# Altium project mb1225.PrjPCB (part 1 of 2)
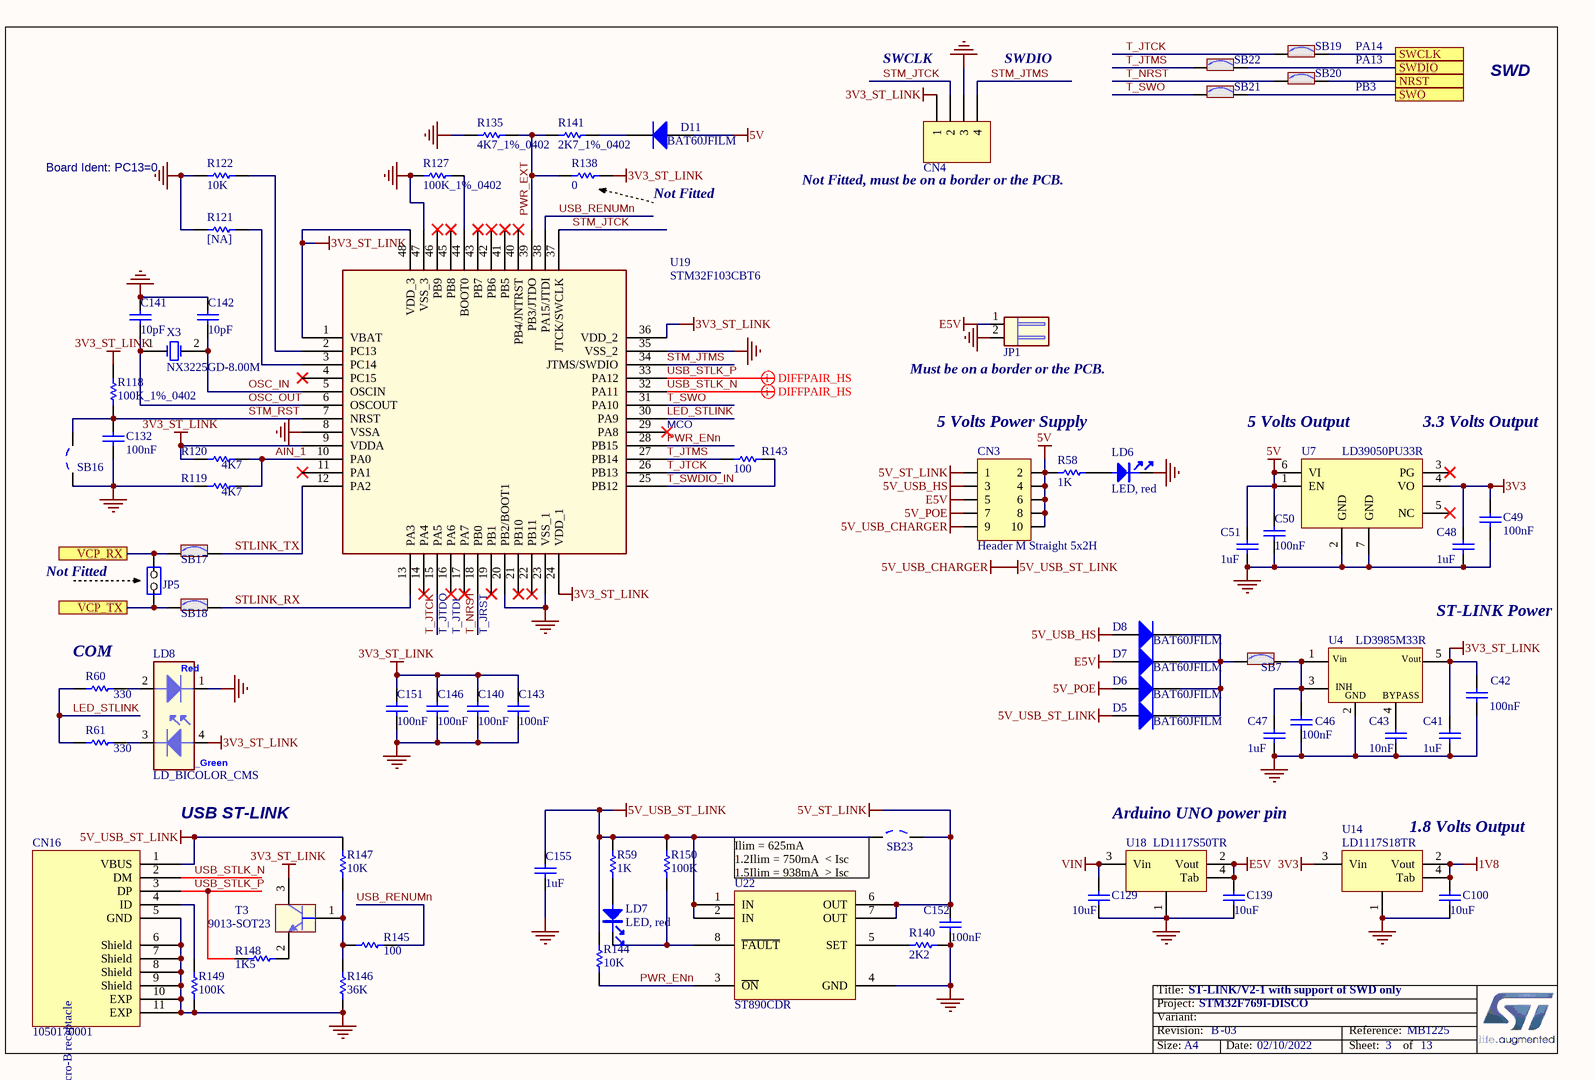
[diagram p0: ST_LINK_V2-1.SCHDOC]
Board_Reference: MB1225; Board_PCB_Revision: B; Board_Name: STM32F769I-DISCO; Board_document_Date: 02/10/2022; Board_Assembly_Revision: 03
8 sheets, 341 parts. Net scope: hierarchical (ports join the sheet entries above them; power ports are global).
Board file: MB1225.PcbDoc
Sheets:
  ST_LINK_V2-1.SCHDOC
  AUDIO.SchDoc
  SDRAM.SchDoc
  QSPI.SchDoc
  USB_OTG_HS.SchDoc
  Ethernet.SchDoc
    U_PoE = PoE.SchDoc
  Peripherals.SchDoc

## Sheet ST_LINK_V2-1.SCHDOC: ST-LINK/V2-1 with support of SWD only
size A4; Date: 29-OCT-2015; Author: A.B; CompanyName: STMicroelectronics; Organization: MCD/TOOLS/GNB; Address1: 12, Rue Jules HOROWITZ; Address2: 38019 Grenoble; Address3: FRANCE; DocumentNumber: MB1225; Revision: B-01; SheetNumber: 3; SheetTotal: 13; Project: STM32F769I-DISCO

### Parts
C41  1uF  [0603C]
C42  100nF  [0402C]
C43  10nF  [0603C]
C46  100nF  [0402C]
C47  1uF  [0603C]
C48  1uF  [0603C]
C49  100nF  [0402C]
C50  100nF  [0402C]
C51  1uF  [0603C]
C100  10uF  [0603C]
C129  10uF  [0805C]
C132  100nF  [0402C]
C139  10uF  [0805C]
C140  100nF  [0402C]
C141  10pF  [0402C]
C142  10pF  [0402C]
C143  100nF  [0402C]
C146  100nF  [0402C]
C151  100nF  [0402C]
C152  100nF  [0402C]
C155  1uF  [0603C]
CN3  Header M Straight 5x2H  [HDR_2X5_2R54]
CN4  Header 4  [HDR_1X4_2R54]  (value not drawn)
CN16  1050170001  [MICRO_USB_B_105017]
D5  BAT60JFILM  [SOD-323]
D6  BAT60JFILM  [SOD-323]
D7  BAT60JFILM  [SOD-323]
D8  BAT60JFILM  [SOD-323]
D11  BAT60JFILM  [SOD-323]
JP1  WF25402-06421  [HDR_1X2_2R54_RA_11R35]  (value not drawn)
JP5  JP2  [SIP2]  (value not drawn)
LD6  LED, red  [0603D]
LD7  LED, red  [0603D]
LD8  LD_BICOLOR_CMS  [LED2_3528]
R58  1K  [0402R]
R59  1K  [0402R]
R60  330  [0402R]
R61  330  [0402R]
R118  100K_1%_0402  [0402R]
R119  4K7  [0402R]
R120  4K7  [0402R]
R121  [NA]  [0402R]
R122  10K  [0402R]
R127  100K_1%_0402  [0402R]
R135  4K7_1%_0402  [0402R]
R138  0  [0402R]
R140  2K2  [0402R]
R141  2K7_1%_0402  [0402R]
R143  100  [0402R]
R144  10K  [0402R]
R145  100  [0402R]
R146  36K  [0402R]
R147  10K  [0402R]
R148  1K5  [0402R]
R149  100K  [0402R]
R150  100K  [0402R]
SB7  Solder Bridge ON  [JP2_SMD]  (value not drawn)
SB16  Solder Bridge OFF  [JP2_SMD]  (value not drawn)
SB17  Solder Bridge ON  [JP2_SMD]  (value not drawn)
SB18  Solder Bridge ON  [JP2_SMD]  (value not drawn)
SB19  Solder Bridge ON  [JP2_SMD]  (value not drawn)
SB20  Solder Bridge ON  [JP2_SMD]  (value not drawn)
SB21  Solder Bridge ON  [JP2_SMD]  (value not drawn)
SB22  Solder Bridge ON  [JP2_SMD]  (value not drawn)
SB23  Solder Bridge OFF  [JP2_SMD]  (value not drawn)
T3  9013-SOT23  [SOT-23]
U4  LD3985M33R  [SOT-23-5L]
U7  LD39050PU33R  [DFN6_0R95_3X3]
U14  LD1117S18TR  [SOT-223]
U18  LD1117S50TR  [SOT-223]
U19  STM32F103CBT6  [LQFP48_0R5_9X9]
U22  ST890CDR  [SOIC8_1R27_4R9X6]
X3  NX3225GD-8.00M  [XTAL_2SM_3R2X2R5_H1]

### Ports
NRST, SWCLK, SWDIO, SWO, VCP_RX, VCP_TX

### Nets
1V8: C100.2 U14.2(Vout) U14.4(Tab)
3V3: C48.2 C49.2 U7.4(VO) U14.3(Vin)
3V3_ST_LINK: C41.1 C42.2 C140.1 C143.2 C146.2 C151.2 CN4.1 LD8.4 R118.2 R120.1 R138.2 T3.3(C) U4.5(Vout) U19.1(VBAT) U19.9(VDDA) U19.24(VDD_1) U19.36(VDD_2) U19.48(VDD_3)
5V: C50.2 C51.2 CN3.2 CN3.4 CN3.6 CN3.8 CN3.10 D11.1(A) R58.1 U7.1(EN) U7.6(VI)
5V_POE: CN3.7 D6.1(A)
5V_ST_LINK: C152.2 CN3.1 SB23.2 U22.6(OUT) U22.7(OUT)
5V_USB_CHARGER: C155.2 CN3.9 CN16.1(VBUS) D5.1(A) R59.2 R144.2 R147.2 R150.2 SB23.1 U22.1(IN) U22.2(IN)  [also labelled 5V_USB_ST_LINK]
5V_USB_HS: CN3.3 D8.1(A)
E5V: C139.2 CN3.5 D7.1(A) JP1.1 U18.2(Vout) U18.4(Tab)
GND: C41.2 C42.1 C43.1 C46.1 C47.1 C48.1 C49.1 C50.1 C51.1 C100.1 C129.1 C132.1 C139.1 C140.2 C141.1 C142.1 C143.1 C146.1 C151.1 C152.1 C155.1 CN4.3 CN16.5(GND) CN16.6(Shield) CN16.7(Shield) CN16.8(Shield) CN16.9(Shield) CN16.10(EXP) CN16.11(EXP) JP1.2 LD6.2 LD8.1 R119.1 R121.1 R122.1 R127.1 R135.1 R140.2 R146.1 R149.1 SB16.1 U4.2(GND) U7.2(GND) U7.7(GND) U14.1 U18.1 U19.8(VSSA) U19.20(PB2/BOOT1) U19.23(VSS_1) U19.35(VSS_2) U19.47(VSS_3) U22.4(GND)  [project net POE7]
VIN: C129.2 U18.3(Vin)
AIN_1: R119.2 R120.2 U19.10(PA0)
LED_STLINK: R60.1 R61.1 U19.30(PA9)
NRST: SB20.2 ; port NRST
OSC_IN: C142.2 U19.5(OSCIN) X3.2(OSC2)
OSC_OUT: C141.2 U19.6(OSCOUT) X3.1(OSC1)
PWR_ENn: R144.1 U19.28(PB15) U22.3(~{ON})
PWR_EXT: R135.2 R138.1 R141.1 U19.39(PB3/JTDO)
STLINK_RX: SB18.2 U19.13(PA3)
STLINK_TX: SB17.2 U19.12(PA2)
STM_JTCK: CN4.2 U19.37(JTCK/SWCLK)
STM_JTMS: CN4.4 U19.34(JTMS/SWDIO)
STM_RST: C132.2 R118.1 SB16.2 U19.7(NRST)
SWCLK: SB19.2 ; port SWCLK
SWDIO: SB22.2 ; port SWDIO
SWO: SB21.2 ; port SWO
T_JTCK: SB19.1 U19.15(PA5) U19.26(PB13)
T_JTMS: R143.1 SB22.1 U19.27(PB14)
T_NRST: SB20.1 U19.18(PB0)
T_SWDIO_IN: R143.2 U19.25(PB12)
T_SWO: SB21.1 U19.31(PA10)
USB_RENUMn: R145.2 U19.38(PA15/JTDI)
USB_STLK_N: CN16.2(DM) U19.32(PA11)
USB_STLK_P: CN16.3(DP) R148.1 U19.33(PA12)
VCP_RX: JP5.2(NO) SB17.1 ; port VCP_RX
VCP_TX: JP5.1(COMMON) SB18.1 ; port VCP_TX
NetC43_2: C43.2 U4.4(BYPASS)
NetC46_2: C46.2 C47.2 SB7.2 U4.1(Vin) U4.3(CE)
NetCN16_4: CN16.4(ID) R149.2
NetD5_2: D5.2(K) D6.2(K) D7.2(K) D8.2(K) SB7.1
NetD11_2: D11.2(K) R141.2
NetLD6_1: LD6.1 R58.2
NetLD7_1: LD7.1 R59.1
NetLD7_2: LD7.2 R150.1 U22.8(~{FAULT})
NetLD8_2: LD8.2 R60.2
NetLD8_3: LD8.3 R61.2
NetR121_2: R121.2 U19.3(PC14)
NetR122_2: R122.2 U19.2(PC13)
NetR127_2: R127.2 U19.44(BOOT0)
NetR140_1: R140.1 U22.5(SET)
NetR145_1: R145.1 R146.2 R147.1 T3.1(B)
NetR148_2: R148.2 T3.2(E)

Not connected (* = marked no-connect by the designer): U7 3(PG)* 5(NC)*; U19 4(PC15)* 11(PA1)* 14(PA4)* 16(PA6)* 17(PA7)* 19(PB1)* 21(PB10)* 22(PB11)* 29(PA8)* 40(PB4/JNTRST)* 41(PB5)* 42(PB6)* 43(PB7)* 45(PB8)* 46(PB9)*

### Layout directives
differential pair: USB_STLK_N, USB_STLK_P

### Notes on the sheet
- SWCLK
- SWDIO
- PA14
- PA13
- PB3
- SWD
- Board Ident: PC13=0
- Not Fitted
- (near CN4) Not Fitted, must be on a border or the PCB.
- (near JP1) Must be on a border or the PCB.
- MCO
- 5 Volts Power Supply
- (near U7) 5 Volts Output
- (near U7) 3.3 Volts Output
- (near JP5) Not Fitted
- (near R60) COM
- T_JTDO
- T_JTDI
- T_JRST
- ST-LINK Power
- USB ST-LINK
- (near SB23) Ilim = 625mA
  1.2Ilim = 750mA  < Isc
  1.5Ilim = 938mA  > Isc
- Arduino UNO power pin
- (near U14) 1.8 Volts Output
- Title:
- Project:
- Size:
- Revision:
- Variant:
- A4
- -
- Date:
- Reference:
- Sheet:
- of
- (in symbol 1050170001) USB_Micro-B receptacle
- (in symbol LD3985M33R) INH
- (in symbol LD_BICOLOR_CMS) Red; _Green

### Library data of the parts
C41 C47 C48 C51 C155 = Cap_1uF_X5R_10%_0603: Capacitor,1uF,16V,X5R,10%,0603,YAGEO; Manuf_Part_1: CC0603KRX5R7BB105; Revision: July-2002: Re-released for DXP Platform.; Value: 1uF; Order: CC0603KRX5R7BB105; Manuf_1: YAGEO
  C155: ECCN_US/EU: n/a
C42 C46 C49 C50 C132 C140 C143 C146 C151 C152 = Cap_100nF_X7R_10%_0402: Capacitor,100nF,16V,X7R,10%,0402,YAGEO; Manuf_Part_1: CC0402KRX7R7BB104; Revision: July-2002: Re-released for DXP Platform.; Value: 100nF; Order: CC0402KRX7R7BB104; Manuf_1: YAGEO
C43 = Cap_10nF_X7R_10%_0603: Capacitor,10nF,50V,X7R,10%,0603,YAGEO; Manuf_Part_1: CC0603KRX7R9BB103; Revision: July-2002: Re-released for DXP Platform.; Value: 10nF; Order: CC0603KRX7R9BB103; Manuf_1: YAGEO
C100 = Cap_10uF_X5R_10%_0603: Capacitor,10uF,6.3V,X5R,10%,0603,YAGEO; Manuf_Part_1: CC0603KRX5R5BB106; Revision: July-2002: Re-released for DXP Platform.; Value: 10uF; Order: CC0603KRX5R5BB106; Manuf_1: YAGEO; ECCN_US/EU: n/a
C129 C139 = Cap_10uF_X5R_10%_0805: Capacitor,10uF,25V,X5R,10%,0805,YAGEO; Manuf_Part_1: CC0805KRX5R8BB106; Revision: July-2002: Re-released for DXP Platform.; Value: 10uF; Order: CC0805KRX5R8BB106; Manuf_1: YAGEO; ECCN_US/EU: n/a
C141 C142 = Cap_10pF_NPO_5%_0402: Capacitor,10pF,50V,NPO,5%,0402,YAGEO; Order: CC0402JRNPO9BN100; Revision: July-2002: Re-released for DXP Platform.; Value: 10pF; Manuf_1: YAGEO; Manuf_Part_1: CC0402JRNPO9BN100; ECCN_US/EU: n/a
CN3 = Header 5X2M: Header Male, 5-Pin, Dual row, Straight, AMD; Manuf_Part_1: 826632-5; Manuf_1: AMD; Distrib: Sub Co; Footprint: HDR2X5H; ECCN_US/EU: n/a; SOFER_FP: HDR_2X5_2R54
CN4 = Header 4: Header, 4-Pin; Fitted: NO; Revision: 17-Jul-2002: Re-released for DXP Platform.; Publisher: Altium Limited; ECCN_US/EU: n/a; SOFER_FP: HDR_1X4_2R54
CN16 = 1050170001: USB-MICRO-B, 1050170001, SMT, MOLEX; ECCN_US/EU: n/a; Manuf_1: MOLEX; Manuf_Part_1: 1050170001; Distrib: DIGIKEY; SOFER_FP: MICRO_USB_B_105017
D5-D8 D11 = BAT60JFILM: Manuf_1: STM; Provided: ST; ECCN_US/EU: EAR99/NEC; Ref St: 9151097; Revision: July-2002: Re-released for DXP Platform.; Order: BAT60JFILM; Manuf_Part_1: BAT60JFILM; Distrib: ST
JP1 = JP2_RA: Header, 2-Pins, Single row, Right Angle, 2.54 mm pitch, DIP; Manuf_1: ATOM; ECCN_US/EU: n/a; Manuf_Part_1: WF25402-06421; Distrib: Sub Co
JP5 = JP2: Fitted: NO; ECCN_US/EU: n/a
LD6 LD7 = LED_red: LED, red, 0603; Manuf_1: everlight; Manuf_Part_1: 19-213-R6C-AP1Q2B/3T; ECCN_US/EU: EAR99/NEC; Order: 19-213-R6C-AP1Q2B/3T
LD8 = LD_BICOLOR_CMS: Bicolor Led; Manuf_Part_1: HSMF-A201-A00J1; Manuf_1: Avago Technologies; Manuf_2: everluck; Manuf_Part_2: LE-RGW35280; Ref St: xxxxxx; ECCN_US/EU: EAR99/NEC; Distrib: RADIOSPARES; Footprint: HSMF-A201
R58 R59 = Res_1K_1%_0402: Resistor,1K,0402,1%,YAGEO; Manuf_Part_1: RC0402FR-071KL; Value: 1K; Manuf_1: YAGEO; Order: RC0402FR-071KL; ECCN_US/EU: n/a
R60 R61 = Res_330_1%_0402: Resistor,330,0402,1%,YAGEO; Manuf_Part_1: RC0402FR-07330RL; Value: 330; ECCN_US/EU: n/a; Manuf_1: YAGEO; Distrib: DIGIKEY; Order: RC0402FR-07330RL
R118 R127 R149 R150 = Res_100K_1%_0402: Resistor,100K,0402,1%,YAGEO; Manuf_Part_1: RC0402FR-07100KL; Manuf_Part_2: RT0402FRE07100KL; Value: 100K; Manuf_1: YAGEO; ECCN_US/EU: n/a; Manuf_2: YAGEO
R119 R120 R135 = Res_4K7_1%_0402: Resistor,4K7,0402,1%,YAGEO; Manuf_Part_1: RC0402FR-074K7L; Manuf_Part_2: RT0402FRE074K7L; Value: 4K7; Manuf_1: YAGEO; ECCN_US/EU: n/a; Manuf_2: YAGEO
R121 = Res_NA_0402: Resistor,[NA],0402; Fitted: NO; Value: [NA]; ECCN_US/EU: n/a
R122 R144 R147 = Res_10K_1%_0402: Resistor,10K,0402,1%,YAGEO; Manuf_Part_1: RC0402FR-0710KL; Value: 10K; Manuf_1: YAGEO; Order: RC0402FR-0710KL; ECCN_US/EU: n/a
R138 = Res_0_5%_0402: Resistor,0,0402,5%,YAGEO; Manuf_Part_1: RC0402JR-070RL; Order: 2363467; Fitted: NO; Value: 0; ECCN_US/EU: n/a; Manuf_1: YAGEO; Distrib: FARNELL
R140 = Res_2K2_1%_0402: Resistor,2K2,0402,1%,YAGEO; Manuf_Part_1: RC0402FR-072K2L; Value: 2K2; Manuf_1: YAGEO; Order: RC0402FR-072K2L; ECCN_US/EU: n/a
R141 = Res_2K7_1%_0402: Resistor,2K7,0402,1%,YAGEO; Manuf_Part_1: RC0402FR-072K7L; Value: 2K7; Manuf_1: YAGEO; Order: RC0402FR-072K7L; ECCN_US/EU: n/a; Distrib: FARNELL
R143 R145 = Res_100_1%_0402: Resistor,100,0402,1%,YAGEO; Manuf_Part_1: RC0402FR-07100RL; Order: 9239111; Value: 100; Manuf_1: YAGEO; ECCN_US/EU: n/a; Distrib: FARNELL
R146 = Res_36K_1%_0402: Resistor,36K,0402,1%,YAGEO; Manuf_Part_1: RC0402FR-0736KL; Value: 36K; Manuf_1: YAGEO; Order: RC0402FR-0736KL; ECCN_US/EU: n/a; Distrib: FARNELL
R148 = Res_1K5_1%_0402: Resistor,1K5,0402,1%,YAGEO; Manuf_Part_1: RC0402FR-071K5L; Value: 1K5; Manuf_1: YAGEO; Order: RC0402FR-071K5L; ECCN_US/EU: n/a; Distrib: FARNELL
SB7 SB17-SB22 = SB_ON: Solder: YES; Revision: July-2002: Re-released for DXP Platform.; ECCN_US/EU: n/a
SB16 SB23 = SB_OFF: Solder: NO; Revision: July-2002: Re-released for DXP Platform.; ECCN_US/EU: n/a
T3 = 9013-SOT23: NPN Bipolar Transistor; Manuf_1: NXP; Manuf_Part_1: BSR14; Order: 1081310; ECCN_US/EU: EAR99/NEC; Revision: July-2002: Re-released for DXP Platform.; Distrib: FARNELL
U4 = LD3985M33R: Ultra low drop-low noise BiCMOS voltage, regulators low ESR capacitors compatible; Manuf_1: STM; Provided: ST; Ref St: 9176161; ECCN_US/EU: EAR99/NEC; Manuf_Part_1: LD3985M33R; Distrib: ST; Order: LD3985M33R
U7 = LD39050P: Ultra low drop-low , 500 mA low quiescent current; Manuf_1: STM; Provided: ST; ECCN_US/EU: EAR99/NEC; Ref St: xxxxxxxx; Distrib: ST; Manuf_Part_1: LD39050PU33R; Order: LD39050PU33R
U14 = LD1117S18TR: LOW DROP FIXED AND ADJUSTABLE POSITIVE VOLTAGE REGULATORS (1.8 Volts); Manuf_1: STM; Ref St: 9176180; ECCN_US/EU: EAR99/NEC; Provided: ST; Manuf_Part_1: LD1117S18TR; Order: LD1117S18TR; Distrib: ST
U18 = LD1117S50TR: IC REG LDO 5V 0.8A SOT223; Manuf_1: STM; Ordered by: ST; ECCN_US/EU: EAR99/NEC; Ref St: 9176133; Manuf_Part_1: LD1117S50TR; Distrib: ST; Order: LD1117S50TR; Provided: ST
U19 = STM32F103CBT6: Medium-density performance line ARM-based 32-bit MCU with 128KB Flash; Manuf_1: STM; Ref St: xxxxxxxx; Provided: ST; ECCN_US/EU: 3A991A2/NEC; Footprint: QFP48 7X7; Manuf_Part_1: STM32F103CBT6; Order: STM32F103CBT6; Distrib: ST
U22 = ST890CDR: 1.2 A current limited high-side power switch with thermal shutdown; Manuf_1: STM; ECCN_US/EU: EAR99/NEC; Provided: ST; Manuf_Part_1: ST890CDR; Distrib: ST; Footprint: SO-8
X3 = XTAL_8M_NX3225GD: Crystal 8Mhz, 8pF, -+50PPM, SMD; Manuf_1: NDK; Manuf_Part_1: NX3225GD 8MHz EXS00A-CG04874; Manuf_Part_2: NX3225GD-8.000M-STD-CRA-3; ECCN_US/EU: EAR99/NEC; NDK Ref: X3127326; Ref St: 9157029; Provided: ST; Order: NX3225GD 8MHz EXS00A-CG04874

## Sheet AUDIO.SchDoc: Audio Codec WOLFSON and Audio Connectors
size A4; Date: 29-OCT-2015; Author: A.B; CompanyName: STMicroelectronics; Organization: MCD/TOOLS/GNB; Address1: 12, Rue Jules HOROWITZ; Address2: 38019 Grenoble; Address3: FRANCE; DocumentNumber: MB1225; Revision: B-01; SheetNumber: 5; SheetTotal: 13; Project: STM32F769I-DISCO
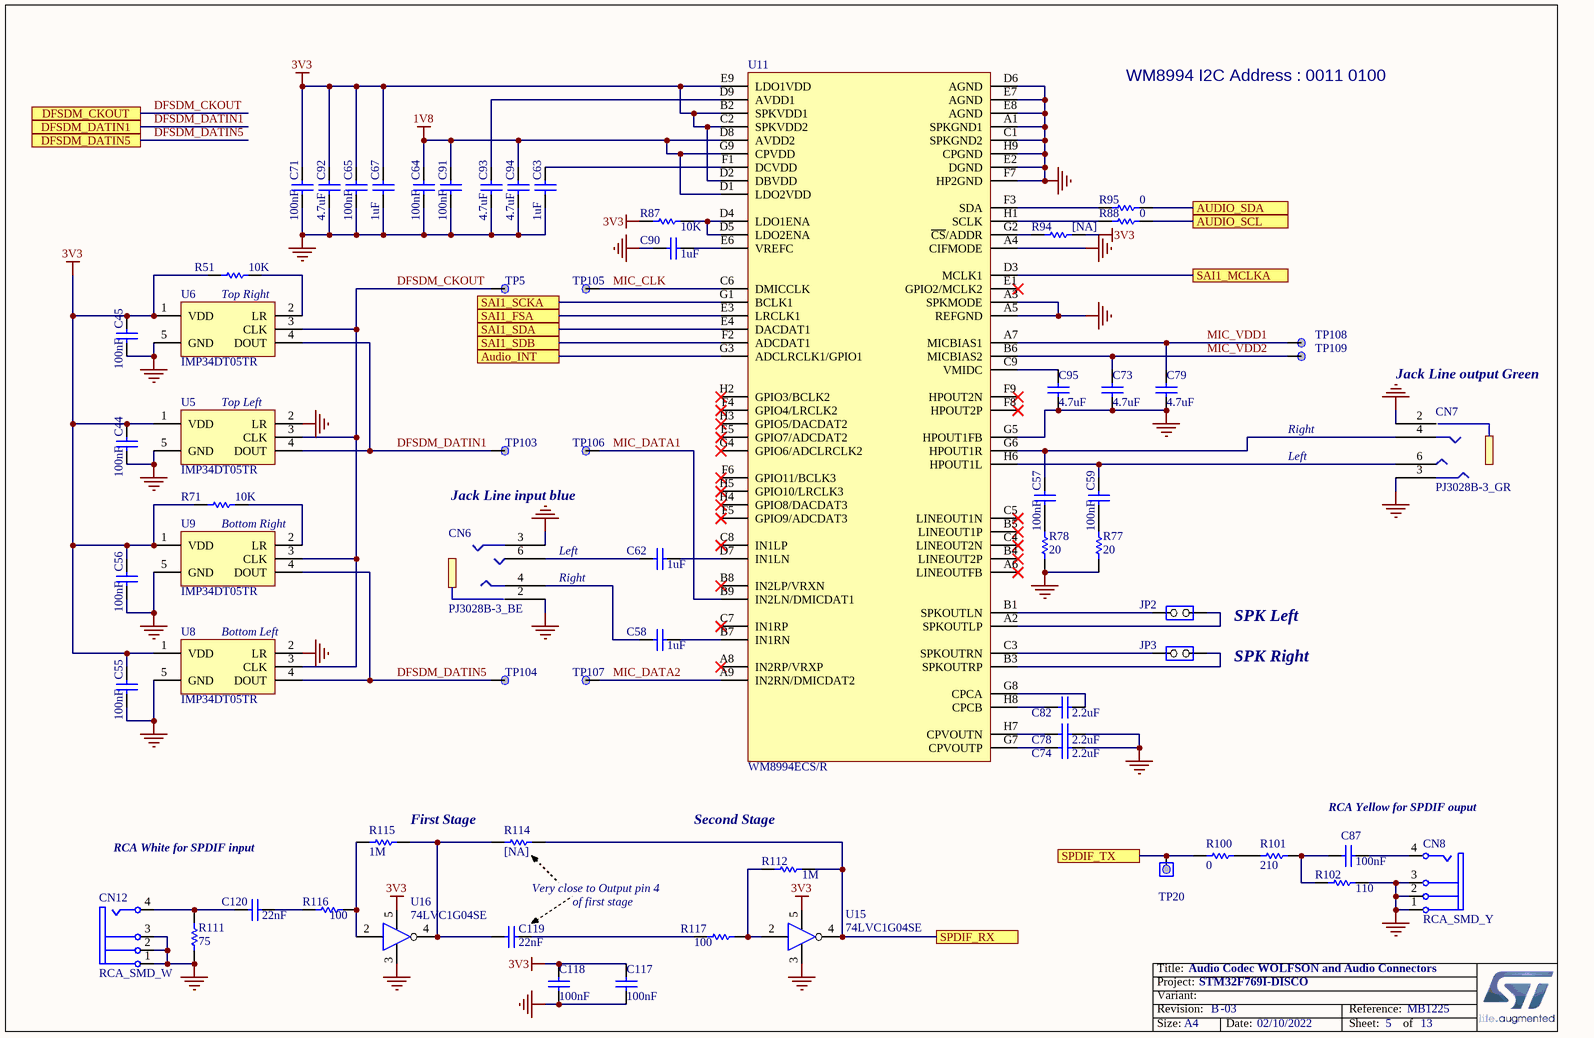
[diagram p1: AUDIO.SchDoc]

### Parts
C44  100nF  [0402C]
C45  100nF  [0402C]
C55  100nF  [0402C]
C56  100nF  [0402C]
C57  100nF  [0402C]
C58  1uF  [0603C]
C59  100nF  [0402C]
C62  1uF  [0603C]
C63  1uF  [0603C]
C64  100nF  [0402C]
C65  100nF  [0402C]
C67  1uF  [0603C]
C71  100nF  [0402C]
C73  4.7uF  [0603C]
C74  2.2uF  [0603C]
C78  2.2uF  [0603C]
C79  4.7uF  [0603C]
C82  2.2uF  [0603C]
C87  100nF  [0402C]
C90  1uF  [0603C]
C91  100nF  [0402C]
C92  4.7uF  [0603C]
C93  4.7uF  [0603C]
C94  4.7uF  [0603C]
C95  4.7uF  [0603C]
C117  100nF  [0402C]
C118  100nF  [0402C]
C119  22nF  [0402C]
C120  22nF  [0402C]
CN6  PJ3028B-3_BE  [PJ3028B]
CN7  PJ3028B-3_GR  [PJ3028B]
CN8  RCA_SMD_Y  [PHONE_JACK_JBB0819100002]
CN12  RCA_SMD_W  [PHONE_JACK_JBB0819100002]
JP2  JP2  [SIP2]  (value not drawn)
JP3  JP2  [SIP2]  (value not drawn)
R51  10K  [0402R]
R71  10K  [0402R]
R77  20  [0402R]
R78  20  [0402R]
R87  10K  [0402R]
R88  0  [0402R]
R94  [NA]  [0402R]
R95  0  [0402R]
R100  0  [0402R]
R101  210  [0402R]
R102  110  [0402R]
R111  75  [0402R]
R112  1M  [0402R]
R114  [NA]  [0402R]
R115  1M  [0402R]
R116  100  [0402R]
R117  100  [0402R]
TP5  TP  [TP_C40]  (value not drawn)
TP20  Test point 1 pin with hole  [TP]  (value not drawn)
TP103  TP  [TP_C40]  (value not drawn)
TP104  TP  [TP_C40]  (value not drawn)
TP105  TP  [TP_C40]  (value not drawn)
TP106  TP  [TP_C40]  (value not drawn)
TP107  TP  [TP_C40]  (value not drawn)
TP108  TP  [TP_C40]  (value not drawn)
TP109  TP  [TP_C40]  (value not drawn)
U5  IMP34DT05TR  [MIC_HCLGA_3X4X1_4LD]
U6  IMP34DT05TR  [MIC_HCLGA_3X4X1_4LD]
U8  IMP34DT05TR  [MIC_HCLGA_3X4X1_4LD]
U9  IMP34DT05TR  [MIC_HCLGA_3X4X1_4LD]
U11  WM8994ECS/R  [BGA72_0R5_4R5X4]
U15  74LVC1G04SE  [SOT-353]
U16  74LVC1G04SE  [SOT-353]

### Ports
Audio_INT, AUDIO_SCL, AUDIO_SDA, DFSDM_CKOUT, DFSDM_DATIN1, DFSDM_DATIN5, SAI1_FSA, SAI1_MCLKA, SAI1_SCKA, SAI1_SDA, SAI1_SDB, SPDIF_RX, SPDIF_TX

### Nets
1V8: C64.1 C91.1 C94.1 U11.D1(LDO2VDD) U11.D8(AVDD2) U11.G9(CPVDD)
3V3: C44.1 C45.1 C55.1 C56.1 C65.1 C67.2 C71.1 C92.1 C117.2 C118.2 R51.2 R71.2 R87.2 R94.2 U5.1(VDD) U6.1(VDD) U8.1(VDD) U9.1(VDD) U11.B2(SPKVDD1) U11.C2(SPKVDD2) U11.D2(DBVDD) U11.E9(LDO1VDD) U15.5(VCC) U16.5(VCC)
GND: C44.2 C45.2 C55.2 C56.2 C63.1 C64.2 C65.2 C67.1 C71.2 C73.1 C74.2 C78.2 C79.1 C90.2 C91.2 C92.2 C93.2 C94.2 C95.1 C117.1 C118.1 CN6.2 CN6.3 CN7.2 CN7.3 CN8.1(Ground) CN8.2(Ground) CN8.3(Ground) CN12.1(Ground) CN12.2(Ground) CN12.3(Ground) R77.2 R78.2 R102.2 R111.1 U5.2(LR) U5.5(GND) U6.5(GND) U8.2(LR) U8.5(GND) U9.5(GND) U11.A1(SPKGND1) U11.A3(SPKMODE) U11.A4(CIFMODE) U11.A5(REFGND) U11.C1(SPKGND2) U11.D6(AGND) U11.E2(DGND) U11.E7(AGND) U11.E8(AGND) U11.F7(HP2GND) U11.G5(HPOUT1FB) U11.H9(CPGND) U15.3(GND) U16.3(GND)  [project net POE7]
Audio_INT: U11.G3(ADCLRCLK1/GPIO1) ; port Audio_INT
AUDIO_SCL: R88.1 ; port AUDIO_SCL
AUDIO_SDA: R95.1 ; port AUDIO_SDA
DFSDM_CKOUT: TP5.1 U5.3(CLK) U6.3(CLK) U8.3(CLK) U9.3(CLK) ; port DFSDM_CKOUT
DFSDM_DATIN1: TP103.1 U5.4(DOUT) U6.4(DOUT) ; port DFSDM_DATIN1
DFSDM_DATIN5: TP104.1 U8.4(DOUT) U9.4(DOUT) ; port DFSDM_DATIN5
MIC_CLK: TP105.1 U11.C6(DMICCLK)
MIC_DATA1: TP106.1 U11.B9(IN2LN/DMICDAT1)
MIC_DATA2: TP107.1 U11.A9(IN2RN/DMICDAT2)
MIC_VDD1: C79.2 TP108.1 U11.A7(MICBIAS1)
MIC_VDD2: C73.2 TP109.1 U11.B6(MICBIAS2)
SAI1_FSA: U11.E3(LRCLK1) ; port SAI1_FSA
SAI1_MCLKA: U11.D3(MCLK1) ; port SAI1_MCLKA
SAI1_SCKA: U11.G1(BCLK1) ; port SAI1_SCKA
SAI1_SDA: U11.E4(DACDAT1) ; port SAI1_SDA
SAI1_SDB: U11.F2(ADCDAT1) ; port SAI1_SDB
SPDIF_RX: R112.2 R114.2 U15.4(Y) ; port SPDIF_RX
SPDIF_TX: R100.1 TP20.1(COMMON) ; port SPDIF_TX
NetC57_1: C57.1 CN7.4 U11.G6(HPOUT1R)
NetC57_2: C57.2 R78.1
NetC58_1: C58.1 U11.B7(IN1RN)
NetC58_2: C58.2 CN6.4
NetC59_1: C59.1 CN7.6 U11.H6(HPOUT1L)
NetC59_2: C59.2 R77.1
NetC62_1: C62.1 U11.D7(IN1LN)
NetC62_2: C62.2 CN6.6
NetC63_2: C63.2 U11.F1(DCVDD)
NetC74_1: C74.1 U11.G7(CPVOUTP)
NetC78_1: C78.1 U11.H7(CPVOUTN)
NetC82_1: C82.1 U11.H8(CPCB)
NetC82_2: C82.2 U11.G8(CPCA)
NetC87_1: C87.1 R101.2 R102.1
NetC87_2: C87.2 CN8.4(Signal)
NetC90_1: C90.1 U11.E6(VREFC)
NetC93_1: C93.1 U11.D9(AVDD1)
NetC95_2: C95.2 U11.C9(VMIDC)
NetC119_1: C119.1 R114.1 R115.2 U16.4(Y)
NetC119_2: C119.2 R117.1
NetC120_1: C120.1 CN12.4(Signal) R111.2
NetC120_2: C120.2 R116.1
NetJP2_1: JP2.1(COMMON) U11.B1(SPKOUTLN)
NetJP2_2: JP2.2(NO) U11.A2(SPKOUTLP)
NetJP3_1: JP3.1(COMMON) U11.C3(SPKOUTRN)
NetJP3_2: JP3.2(NO) U11.B3(SPKOUTRP)
NetR51_1: R51.1 U6.2(LR)
NetR71_1: R71.1 U9.2(LR)
NetR87_1: R87.1 U11.D4(LDO1ENA) U11.D5(LDO2ENA)
NetR88_2: R88.2 U11.H1(SCLK)
NetR94_1: R94.1 U11.G2(~{CS}/ADDR)
NetR95_2: R95.2 U11.F3(SDA)
NetR100_2: R100.2 R101.1
NetR112_1: R112.1 R117.2 U15.2(A)
NetR115_1: R115.1 R116.2 U16.2(A)

Not connected (* = marked no-connect by the designer): U11 A6(LINEOUTFB)* A8(IN2RP/VRXP)* B4(LINEOUT2P)* B5(LINEOUT1P)* B8(IN2LP/VRXN)* C4(LINEOUT2N)* C5(LINEOUT1N)* C7(IN1RP)* C8(IN1LP)* E1(GPIO2/MCLK2)* E5(GPIO7/ADCDAT2)* F4(GPIO4/LRCLK2)* F5(GPIO9/ADCDAT3)* F6(GPIO11/BCLK3)* F8(HPOUT2P)* F9(HPOUT2N)* G4(GPIO6/ADCLRCLK2)* H2(GPIO3/BCLK2)* H3(GPIO5/DACDAT2)* H4(GPIO8/DACDAT3)* H5(GPIO10/LRCLK3)*; U15 1(NC); U16 1(NC)

### Notes on the sheet
- WM8994 I2C Address : 0011 0100
- Top Right
- (near CN7) Jack Line output Green
- (near U5) Top Left
- Right
- Jack Line input blue
- Left
- Bottom Right
- (near U8) Bottom Left
- SPK Left
- SPK Right
- RCA White for SPDIF input
- First Stage
- Second Stage
- RCA Yellow for SPDIF ouput
- Very close to Output pin 4
- of first stage
- Title:
- Project:
- Size:
- Revision:
- Variant:
- A4
- -
- Date:
- Reference:
- Sheet:
- of

### Library data of the parts
C44 C45 C55-C57 C59 C64 C65 C71 C87 C91 C117 C118 = Cap_100nF_X7R_10%_0402: as C42 on sheet ST_LINK_V2-1; Revision: July-2002: Re-released for DXP Platform.; Value: 100nF; Order: CC0402KRX7R7BB104; Manuf_1: YAGEO
  C44 C45 C55-C57 C59 C64 C65 C71 C91: ECCN_US/EU: n/a
C58 C62 C63 C67 C90 = Cap_1uF_X5R_10%_0603: as C41 on sheet ST_LINK_V2-1; Revision: July-2002: Re-released for DXP Platform.; Value: 1uF; Order: CC0603KRX5R7BB105; Manuf_1: YAGEO; ECCN_US/EU: n/a
C73 C79 C92-C95 = Cap_4.7uF_X5R_10%_0603: Capacitor,4.7uF,16V, X5R,10%,0603,YAGEO; Manuf_Part_1: CC0603KRX5R7BB475; Order: CC0603KRX5R7BB105; Revision: July-2002: Re-released for DXP Platform.; Value: 4.7uF; Manuf_1: YAGEO; ECCN_US/EU: n/a
C74 C78 C82 = Cap_2.2uF_X5R_10%_0603: Capacitor,2.2uF,10V, X5R,10%,0603,YAGEO; Manuf_Part_1: CC0603KRX5R6BB225; Manuf_Part_2: C0603C225K8PACTU; Manuf_2: KEMET; Revision: July-2002: Re-released for DXP Platform.; Value: 2.2uF; Order: *; Manuf_1: YAGEO; ECCN_US/EU: n/a
C119 C120 = Cap_22nF_X7R_10%_0402: Capacitor,22nF,16V,X7R,10%,0402,YAGEO; Manuf_Part_1: CC0402KRX7R7BB223; Revision: July-2002: Re-released for DXP Platform.; Value: 22nF; Order: CC0402KRX7R7BB223; Manuf_1: YAGEO; ECCN_US/EU: n/a
CN6 = PJ3028B-3_BE: Connector Jack Stereo 3.5mm, female SMT, Blue (Line input); Manuf_Part_2: PJ30280-3_BE; ECCN_US/EU: n/a; Manuf_Part_1: PJ3028B-3_BE; Manuf_1: http://ww.qiaod.com
CN7 = PJ3028B-3_GR: Connector Jack Stereo 3.5mm, female SMT, Green (Line output); Manuf_Part_2: PJ30280-3_GR; ECCN_US/EU: n/a; Manuf_Part_1: PJ3028B-3_GR; Manuf_1: http://ww.qiaod.com
CN8 = RCA_SMD_Y: RCA Phono Jack, Right Angle, SMD, Yellow; Manuf_Part_1: JBB0819100002; Manuf_1: JIUBABA; Manuf_2: CUI Inc; Manuf_Part_2: RCJ-014-SMT; Distrib: Sub Co; ECCN_US/EU: n/a
CN12 = RCA_SMD_W: RCA Phono Jack, Right Angle, SMD, White; Manuf_Part_1: JBB0819100004; Manuf_1: JIUBABA; Manuf_2: CUI Inc; Manuf_Part_2: RCJ-013-SMT; Distrib: Sub Co; ECCN_US/EU: n/a
JP2 JP3 = JP2: Fitted: NO; ECCN_US/EU: n/a
R51 R71 R87 = Res_10K_1%_0402: as R122 on sheet ST_LINK_V2-1; Value: 10K; Manuf_1: YAGEO; Order: RC0402FR-0710KL; ECCN_US/EU: n/a
R77 R78 = Res_20_1%_0402: Resistor,20,0402,1%,YAGEO; Manuf_Part_1: RC0402FR-0720RL; Value: 20; Manuf_1: YAGEO; Order: *; ECCN_US/EU: n/a
R88 R95 R100 = Res_0_5%_0402: Resistor,0,0402,5%,YAGEO; Manuf_Part_1: RC0402JR-070RL; Order: 2363467; Value: 0; ECCN_US/EU: n/a; Manuf_1: YAGEO; Distrib: FARNELL
R94 R114 = Res_NA_0402: Resistor,[NA],0402; Fitted: NO; Value: [NA]; ECCN_US/EU: n/a
R101 = Res_210_1%_0402: Resistor,210,0402,1%,YAGEO; Manuf_Part_1: RC0402FR-07210RL; Value: 210; Manuf_1: YAGEO; Order: *; ECCN_US/EU: n/a; Distrib: DIGIKEY
R102 = Res_110_1%_0402: Resistor,110,0402,1%,YAGEO; Manuf_Part_1: RC0402FR-07110RL; Value: 110; Manuf_1: YAGEO; Order: *; ECCN_US/EU: n/a; Distrib: Distrib
R111 = Res_75_1%_0402: Resistor,75,0402,1%,YAGEO; Manuf_Part_1: RC0402FR-0775RL; Order: 311-75.0LRTR-ND; Value: 75; Manuf_1: YAGEO; ECCN_US/EU: n/a; Distrib: DIGIKEY
R112 R115 = Res_1M_1%_0402: Resistor,1M,0402,1%,YAGEO; Manuf_Part_1: RC0402FR-071ML; Value: 1M; Manuf_1: YAGEO; Order: RC0402FR-071ML; ECCN_US/EU: n/a
R116 R117 = Res_100_1%_0402: as R143 on sheet ST_LINK_V2-1; Value: 100; Manuf_1: YAGEO; ECCN_US/EU: n/a; Distrib: FARNELL
TP5 TP103-TP109 = TP: Test Point; ECCN_US/EU: n/a
TP20 = TP1: Test Point; Fitted: NO; ECCN_US/EU: n/a
U5 U6 U8 U9 = MCD-01715: MEMS audio sensor omnidirectional digital microphone for industrial applications; BMS_Part_Number: 9177995; Part_Type: IC; Part_Preference: Recommended; Manufacturer: STMICROELECTRONICS; Manufacturer_HQ_COO: EU; Component_Country_Of_Origin: Philippines; Internal_Part_Number: MCD-01715; Value: IMP34DT05TR; Status: Released; Manufacturer_Part_Number: IMP34DT05TR; Package: HCLGA-4LD; ComponentLink1URL: http://tunmcdsvn.tun.st.com/Component_Datasheet_Library/Trunk/IC/STM_Digital-Microphone_IMP34DT05TR
U11 = WM8994ECS/R: Multi-Channel Audio Hub CODEC for Smartphones; Manuf_1: Cirrus Logic; ECCN_US/EU: EAR99/NEC; Manuf_Part_1: WM8994ECS/R; Distrib: Cirrus Logic
U15 U16 = 74LVC1G04SE: Single inverter gate with a standard push-pull output. (1.65V to 5.5V); Manuf_Part_1: 74LVC1G04SE-7; Manuf_1: DIODES; Order: 1845218; ECCN_US/EU: EAR99/NEC; Footprint: SOT353; Distrib: FARNELL

## Sheet SDRAM.SchDoc: SDRAM (MICRON)
size A4; Date: 29-OCT-2015; Author: A.B; CompanyName: STMicroelectronics; Organization: MCD/TOOLS/GNB; Address1: 12, Rue Jules HOROWITZ; Address2: 38019 Grenoble; Address3: FRANCE; DocumentNumber: MB1225; Revision: B-01; SheetNumber: 6; SheetTotal: 13; Project: STM32F769I-DISCO
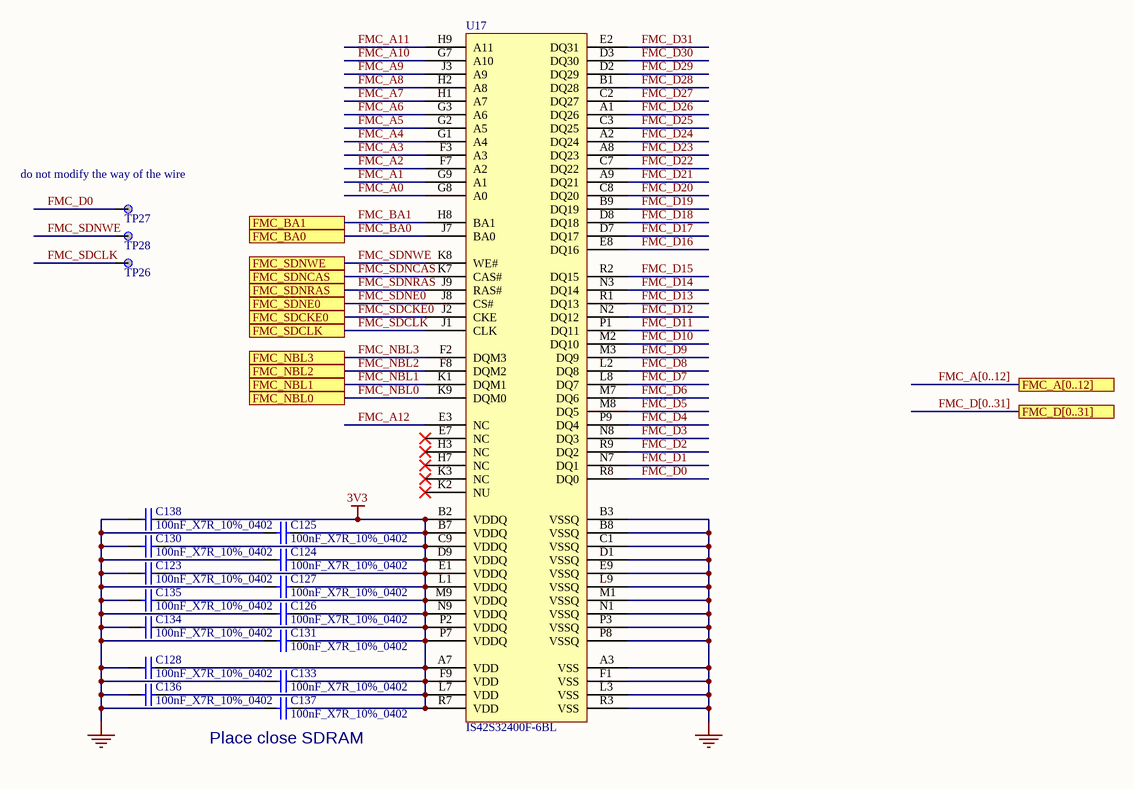
[diagram p2: SDRAM.SchDoc]

### Parts
C123  100nF_X7R_10%_0402  [0402C]
C124  100nF_X7R_10%_0402  [0402C]
C125  100nF_X7R_10%_0402  [0402C]
C126  100nF_X7R_10%_0402  [0402C]
C127  100nF_X7R_10%_0402  [0402C]
C128  100nF_X7R_10%_0402  [0402C]
C130  100nF_X7R_10%_0402  [0402C]
C131  100nF_X7R_10%_0402  [0402C]
C133  100nF_X7R_10%_0402  [0402C]
C134  100nF_X7R_10%_0402  [0402C]
C135  100nF_X7R_10%_0402  [0402C]
C136  100nF_X7R_10%_0402  [0402C]
C137  100nF_X7R_10%_0402  [0402C]
C138  100nF_X7R_10%_0402  [0402C]
TP26  TP  [TP_C40]  (value not drawn)
TP27  TP  [TP_C40]  (value not drawn)
TP28  TP  [TP_C40]  (value not drawn)
U17  IS42S32400F-6BL  [ICC_VFBGA90_8X13_P080]

### Ports
FMC_A[0..12], FMC_BA0, FMC_BA1, FMC_D[0..31], FMC_NBL0, FMC_NBL1, FMC_NBL2, FMC_NBL3, FMC_SDCKE0, FMC_SDCLK, FMC_SDNCAS, FMC_SDNE0, FMC_SDNRAS, FMC_SDNWE

### Nets
3V3: C123.2 C124.2 C125.2 C126.2 C127.2 C128.2 C130.2 C131.2 C133.2 C134.2 C135.2 C136.2 C137.2 C138.2 U17.A7(VDD) U17.B2(VDDQ) U17.B7(VDDQ) U17.C9(VDDQ) U17.D9(VDDQ) U17.E1(VDDQ) U17.F9(VDD) U17.L1(VDDQ) U17.L7(VDD) U17.M9(VDDQ) U17.N9(VDDQ) U17.P2(VDDQ) U17.P7(VDDQ) U17.R7(VDD)
GND: C123.1 C124.1 C125.1 C126.1 C127.1 C128.1 C130.1 C131.1 C133.1 C134.1 C135.1 C136.1 C137.1 C138.1 U17.A3(VSS) U17.B3(VSSQ) U17.B8(VSSQ) U17.C1(VSSQ) U17.D1(VSSQ) U17.E9(VSSQ) U17.F1(VSS) U17.L3(VSS) U17.L9(VSSQ) U17.M1(VSSQ) U17.N1(VSSQ) U17.P3(VSSQ) U17.P8(VSSQ) U17.R3(VSS)  [project net POE7]
FMC_A0: U17.G8(A0)
FMC_A1: U17.G9(A1)
FMC_A2: U17.F7(A2)
FMC_A3: U17.F3(A3)
FMC_A4: U17.G1(A4)
FMC_A5: U17.G2(A5)
FMC_A6: U17.G3(A6)
FMC_A7: U17.H1(A7)
FMC_A8: U17.H2(A8)
FMC_A9: U17.J3(A9)
FMC_A10: U17.G7(A10)
FMC_A11: U17.H9(A11)
FMC_A12: U17.E3(NC)
FMC_BA0: U17.J7(BA0) ; port FMC_BA0
FMC_BA1: U17.H8(BA1) ; port FMC_BA1
FMC_D0: TP27.1 U17.R8(DQ0)
FMC_D1: U17.N7(DQ1)
FMC_D2: U17.R9(DQ2)
FMC_D3: U17.N8(DQ3)
FMC_D4: U17.P9(DQ4)
FMC_D5: U17.M8(DQ5)
FMC_D6: U17.M7(DQ6)
FMC_D7: U17.L8(DQ7)
FMC_D8: U17.L2(DQ8)
FMC_D9: U17.M3(DQ9)
FMC_D10: U17.M2(DQ10)
FMC_D11: U17.P1(DQ11)
FMC_D12: U17.N2(DQ12)
FMC_D13: U17.R1(DQ13)
FMC_D14: U17.N3(DQ14)
FMC_D15: U17.R2(DQ15)
FMC_D16: U17.E8(DQ16)
FMC_D17: U17.D7(DQ17)
FMC_D18: U17.D8(DQ18)
FMC_D19: U17.B9(DQ19)
FMC_D20: U17.C8(DQ20)
FMC_D21: U17.A9(DQ21)
FMC_D22: U17.C7(DQ22)
FMC_D23: U17.A8(DQ23)
FMC_D24: U17.A2(DQ24)
FMC_D25: U17.C3(DQ25)
FMC_D26: U17.A1(DQ26)
FMC_D27: U17.C2(DQ27)
FMC_D28: U17.B1(DQ28)
FMC_D29: U17.D2(DQ29)
FMC_D30: U17.D3(DQ30)
FMC_D31: U17.E2(DQ31)
FMC_NBL0: U17.K9(DQM0) ; port FMC_NBL0
FMC_NBL1: U17.K1(DQM1) ; port FMC_NBL1
FMC_NBL2: U17.F8(DQM2) ; port FMC_NBL2
FMC_NBL3: U17.F2(DQM3) ; port FMC_NBL3
FMC_SDCKE0: U17.J2(CKE) ; port FMC_SDCKE0
FMC_SDCLK: TP26.1 U17.J1(CLK) ; port FMC_SDCLK
FMC_SDNCAS: U17.K7(CAS#) ; port FMC_SDNCAS
FMC_SDNE0: U17.J8(CS#) ; port FMC_SDNE0
FMC_SDNRAS: U17.J9(RAS#) ; port FMC_SDNRAS
FMC_SDNWE: TP28.1 U17.K8(WE#) ; port FMC_SDNWE

Not connected (* = marked no-connect by the designer): U17 E7(NC)* H3(NC)* H7(NC)* K2(NU)* K3(NC)*

### Buses and harness runs
bus FMC_A[0..12] = port FMC_A[0..12]
bus FMC_D[0..31] = port FMC_D[0..31]

### Notes on the sheet
- (near TP27) do not modify the way of the wire
- (near C137) Place close SDRAM
- Title:
- Project:
- Size:
- Revision:
- Variant:
- A4
- -
- Date:
- Reference:
- Sheet:
- of

### Library data of the parts
C123-C128 C130 C131 C133-C138 = Cap_100nF_X7R_10%_0402: as C42 on sheet ST_LINK_V2-1; Revision: July-2002: Re-released for DXP Platform.; Value: 100nF; Order: CC0402KRX7R7BB104; Manuf_1: YAGEO; ECCN_US/EU: n/a
TP26-TP28 = TP: Test Point; ECCN_US/EU: n/a
U17 = MCD-01977: SDRAM 128MBit 166MHZ 90BGA; Part_Type: IC; Part_Preference: Recommended; Manufacturer: ISSI; Component_Country_Of_Origin: China, Taiwan; Internal_Part_Number: MCD-01977; Value: IS42S32400F-6BL; Status: Released; Manufacturer_Part_Number: IS42S32400F-6BL; ComponentLink1URL: http://tunmcdsvn.tun.st.com/Component_Datasheet_Library/Trunk/IC/ISSI_IS42S32400F-6BL; Order_Code_Digikey: IS42S32400F-6BL-ND; Order_Code_Farnell: N/A; Order_Code_RS: N/A

## Sheet QSPI.SchDoc: Quad SPI Flash Memory (MICRON)
size A4; Date: 29-OCT-2015; Author: A.B; CompanyName: STMicroelectronics; Organization: MCD/TOOLS/GNB; Address1: 12, Rue Jules HOROWITZ; Address2: 38019 Grenoble; Address3: FRANCE; DocumentNumber: MB1225; Revision: B-01; SheetNumber: 7; SheetTotal: 13; Project: STM32F769I-DISCO
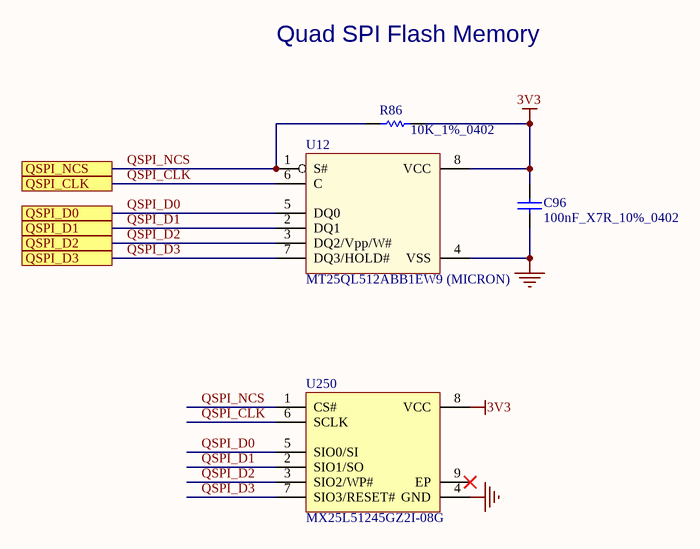
[diagram p3: QSPI.SchDoc]

### Parts
C96  100nF_X7R_10%_0402  [0402C]
R86  10K_1%_0402  [0402R]
U12  MT25QL512ABB1EW9 (MICRON)  [DFN8_1R27_6X8_TP4R8X5R16]
U250  MX25L51245GZ2I-08G  [ICC_WSON8-EPAD_8X6_P127]

### Ports
QSPI_CLK, QSPI_D0, QSPI_D1, QSPI_D2, QSPI_D3, QSPI_NCS

### Nets
3V3: C96.2 R86.2 U12.8(VCC) U250.8(VCC)
GND: C96.1 U12.4(VSS) U250.4(GND)  [project net POE7]
QSPI_CLK: U12.6(C) U250.6(SCLK) ; port QSPI_CLK
QSPI_D0: U12.5(DQ0) U250.5(SIO0/SI) ; port QSPI_D0
QSPI_D1: U12.2(DQ1) U250.2(SIO1/SO) ; port QSPI_D1
QSPI_D2: U12.3(DQ2/Vpp/W#) U250.3(SIO2/WP#) ; port QSPI_D2
QSPI_D3: U12.7(DQ3/HOLD#) U250.7(SIO3/RESET#) ; port QSPI_D3
QSPI_NCS: R86.1 U12.1(S#) U250.1(CS#) ; port QSPI_NCS

Not connected (* = marked no-connect by the designer): U250 9(EP)*

### Notes on the sheet
- Quad SPI Flash Memory
- Title:
- Project:
- Size:
- Revision:
- Variant:
- A4
- -
- Date:
- Reference:
- Sheet:
- of

### Library data of the parts
C96 = Cap_100nF_X7R_10%_0402: as C42 on sheet ST_LINK_V2-1; Revision: July-2002: Re-released for DXP Platform.; Value: 100nF; Order: CC0402KRX7R7BB104; Manuf_1: YAGEO; ECCN_US/EU: n/a
R86 = Res_10K_1%_0402: as R122 on sheet ST_LINK_V2-1; Value: 10K; Manuf_1: YAGEO; Order: RC0402FR-0710KL; ECCN_US/EU: n/a
U12 = MT25QL512ABB1EW9: 512Mb, 3V, Multiple I/O Serial Flash Memory, Quad/Dual; Manuf_Part_2: N25Q512A13GF840E; Manuf_Part_1: MT25QL512ABB1EW9-0SIT; ECCN_US/EU: 3A991/NEC; Provided: ST; Ref St: xxxxxxxx; Note: MX25L51245GZ2I-08G can also be use but with a different footprint; Fitted: NO; Manuf_1: MICRON; Distrib: MICRON
U250 = MCD-01077: 3V 512M-BIT CMOS MXSMIO FLASH MEMORY; Part_Type: IC; Part_Preference: Recommended; Manufacturer: MACRONIX; Component_Country_Of_Origin: Unknown; Internal_Part_Number: MCD-01077; Value: MX25L51245GZ2I-08G; Status: New; Manufacturer_Part_Number: MX25L51245GZ2I-08G; Package: WSON; ComponentLink1URL: http://tunmcdsvn.tun.st.com/Component_Datasheet_Library/Trunk/IC/MXIC_Flash_MX25L51245GZ2I-08G/MXIC_Flash_MX25L51245GZ2I-08G.pdf

## Sheet USB_OTG_HS.SchDoc: USB OTG HS PHY with micro A-B connector
size A4; Date: 29-OCT-2015; Author: A.B; CompanyName: STMicroelectronics; Organization: MCD/TOOLS/GNB; Address1: 12, Rue Jules HOROWITZ; Address2: 38019 Grenoble; Address3: FRANCE; DocumentNumber: MB1225; Revision: B-01; SheetNumber: 9; SheetTotal: 13; Project: STM32F769I-DISCO
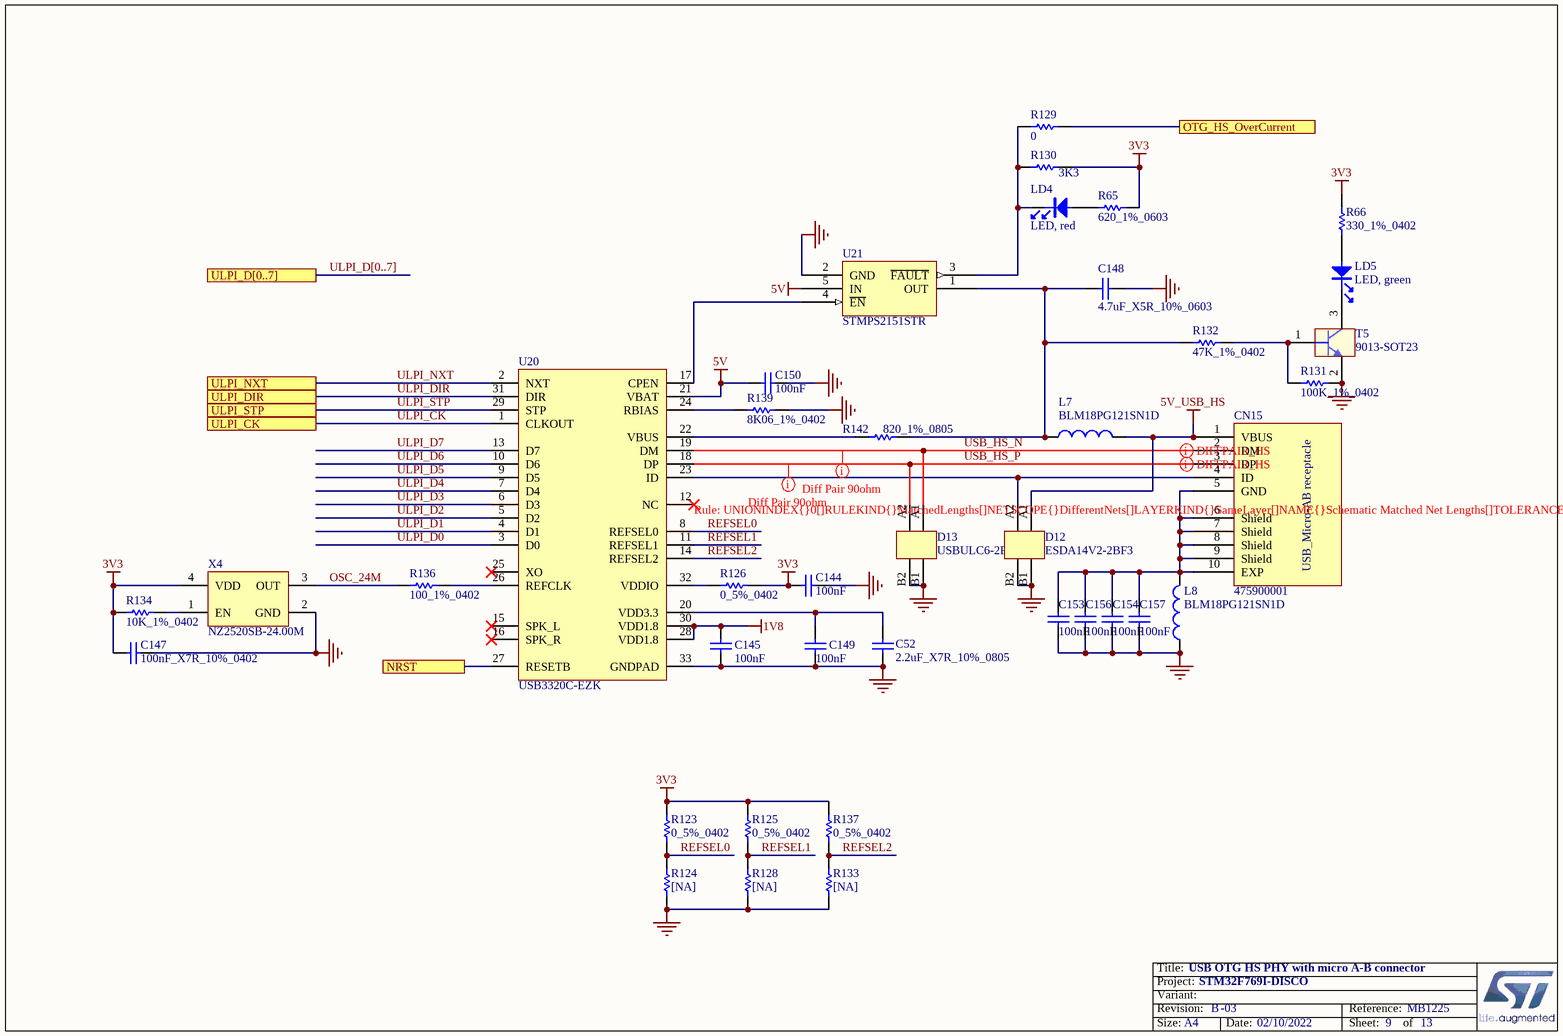
[diagram p4: USB_OTG_HS.SchDoc]

### Parts
C52  2.2uF_X7R_10%_0805  [TAN-A]
C144  100nF  [0402C]
C145  100nF  [0402C]
C147  100nF_X7R_10%_0402  [0402C]
C148  4.7uF_X5R_10%_0603  [0603C]
C149  100nF  [0402C]
C150  100nF  [0402C]
C153  100nF  [0402C]
C154  100nF  [0402C]
C156  100nF  [0402C]
C157  100nF  [0402C]
CN15  475900001  [MOLEX_47590001]
D12  ESDA14V2-2BF3  [BGA4_0R4_0R8X0R8]
D13  USBULC6-2F3  [BGA4_0R4_0R8X0R8]
L7  BLM18PG121SN1D  [0603L]
L8  BLM18PG121SN1D  [0603L]
LD4  LED, red  [0603D]
LD5  LED, green  [0603D]
R65  620_1%_0603  [0603R]
R66  330_1%_0402  [0402R]
R123  0_5%_0402  [0402R]
R124  [NA]  [0402R]
R125  0_5%_0402  [0402R]
R126  0_5%_0402  [0402R]
R128  [NA]  [0402R]
R129  0  [0402R]
R130  3K3  [0402R]
R131  100K_1%_0402  [0402R]
R132  47K_1%_0402  [0402R]
R133  [NA]  [0402R]
R134  10K_1%_0402  [0402R]
R136  100_1%_0402  [0402R]
R137  0_5%_0402  [0402R]
R139  8K06_1%_0402  [0402R]
R142  820_1%_0805  [0805R]
T5  9013-SOT23  [SOT-23]
U20  USB3320C-EZK  [QFN32_0R5_5X5]
U21  STMPS2151STR  [SOT23-5]
X4  NZ2520SB-24.00M  [OSC_4SM_2R5X2]

### Ports
NRST, OTG_HS_OverCurrent, ULPI_CK, ULPI_D[0..7], ULPI_DIR, ULPI_NXT, ULPI_STP

### Nets
1V8: C145.2 U20.28(VDD1.8) U20.30(VDD1.8)
3V3: C144.1 C147.1 R65.2 R66.2 R123.2 R125.2 R126.2 R130.1 R134.1 R137.2 X4.4(VDD)
5V: C150.1 U20.21(VBAT) U21.5(IN)
5V_USB_HS: CN15.1(VBUS) D12.A1 L7.2
GND: C52.1 C144.2 C145.1 C147.2 C148.2 C149.1 C150.2 C153.1 C154.1 C156.1 C157.1 D12.B1 D12.B2 D13.B1 D13.B2 L8.1 R124.1 R128.1 R131.2 R133.1 R139.2 T5.2(E) U20.33(GNDPAD) U21.2(GND) X4.2(GND)  [project net POE7]
NRST: U20.27(RESETB) ; port NRST
OSC_24M: R136.1 X4.3(OUT)
OTG_HS_OverCurrent: R129.2 ; port OTG_HS_OverCurrent
REFSEL0: R123.1 R124.2 U20.8(REFSEL0)
REFSEL1: R125.1 R128.2 U20.11(REFSEL1)
REFSEL2: R133.2 R137.1 U20.14(REFSEL2)
ULPI_CK: U20.1(CLKOUT) ; port ULPI_CK
ULPI_D0: U20.3(D0)
ULPI_D1: U20.4(D1)
ULPI_D2: U20.5(D2)
ULPI_D3: U20.6(D3)
ULPI_D4: U20.7(D4)
ULPI_D5: U20.9(D5)
ULPI_D6: U20.10(D6)
ULPI_D7: U20.13(D7)
ULPI_DIR: U20.31(DIR) ; port ULPI_DIR
ULPI_NXT: U20.2(NXT) ; port ULPI_NXT
ULPI_STP: U20.29(STP) ; port ULPI_STP
USB_HS_N: CN15.2(DM) D13.A1 U20.19(DM)
USB_HS_P: CN15.3(DP) D13.A2 U20.18(DP)
NetC52_2: C52.2 C149.2 U20.20(VDD3.3)
NetC148_1: C148.1 L7.1 R132.1 R142.2 U21.1(OUT)
NetC153_2: C153.2 C154.2 C156.2 C157.2 CN15.5(GND) CN15.6(Shield) CN15.7(Shield) CN15.8(Shield) CN15.9(Shield) CN15.10(EXP) L8.2
NetCN15_4: CN15.4(ID) D12.A2 U20.23(ID)
NetLD4_1: LD4.1 R65.1
NetLD4_2: LD4.2 R129.1 R130.2 U21.3(~{FAULT})
NetLD5_1: LD5.1 R66.1
NetLD5_2: LD5.2 T5.3(C)
NetR126_1: R126.1 U20.32(VDDIO)
NetR131_1: R131.1 R132.2 T5.1(B)
NetR134_2: R134.2 X4.1(EN)
NetR136_2: R136.2 U20.26(REFCLK)
NetR139_1: R139.1 U20.24(RBIAS)
NetR142_1: R142.1 U20.22(VBUS)
NetU20_17: U20.17(CPEN) U21.4(~{EN})

Not connected (* = marked no-connect by the designer): U20 12(NC)* 15(SPK_L)* 16(SPK_R)* 25(XO)*

### Buses and harness runs
bus ULPI_D[0..7] = port ULPI_D[0..7]

### Layout directives
differential pair: USB_HS_N, USB_HS_P
rule Matched Net Lengths [Tolerance = 150mil]: USB_HS_N, USB_HS_P

### Notes on the sheet
- Title:
- Project:
- Size:
- Revision:
- Variant:
- A4
- -
- Date:
- Reference:
- Sheet:
- of
- (in symbol 475900001) USB_Micro-AB receptacle

### Library data of the parts
C52 = Cap_2.2uF_X7R_10%_0805: Capacitor,2.2uF,16V, X7R,10%,0805,YAGEO; Manuf_Part_1: CC0805KKX7R7BB225; Revision: July-2002: Re-released for DXP Platform.; Value: 2.2uF; Order: CC0805KKX7R7BB225; Manuf_1: YAGEO; ECCN_US/EU: n/a
C144 C145 C147 C149 C150 C153 C154 C156 C157 = Cap_100nF_X7R_10%_0402: as C42 on sheet ST_LINK_V2-1; Revision: July-2002: Re-released for DXP Platform.; Value: 100nF; Order: CC0402KRX7R7BB104; Manuf_1: YAGEO
  C147: ECCN_US/EU: n/a
C148 = Cap_4.7uF_X5R_10%_0603: as C73 on sheet AUDIO; Revision: July-2002: Re-released for DXP Platform.; Value: 4.7uF; Manuf_1: YAGEO; ECCN_US/EU: n/a
CN15 = 475900001: USB-MICRO-AB, 47590-0001, SMT, MOLEX; Manuf_Part_1: 47590-0001; Manuf_1: MOLEX; ECCN_US/EU: n/a
D12 = ESDA14V2-2BF3: Quad bidirectional Transil array for ESD protection; Manuf_1: STM; ECCN_US/EU: EAR99/NEC; Provided: ST; Ref St: 9179040; Distrib: ST; Manuf_Part_1: ESDA14V2-2BF3
D13 = USBULC6-2F3: 2-line Transil, (TVS), ultralow capacitance protection for high speed USB; Manuf_1: STM; ECCN_US/EU: EAR99/NEC; Ref St: 9151090; Provided: ST; Manuf_Part_1: USBULC6-2F3; Distrib: ST
L7 L8 = BEAD_120R_2A_0603: Bead,120R,2A,0603,BLM18PG121SN1D,MURATA; Manuf_Part_3: FCM1608KF-601T03; Manuf_2: TDK; Manuf_Part_2: MPZ1608S300A; Manuf_3: Tai-tech; Value: 100uH; Description_3: Bead,600R,350mA,0603,FCM1608KF-601T03,Tai-tech; Description_2: Bead,30R,5A,0603,MPZ1608S300A,TDK; Revision: July-2002: Re-released for DXP Platform.; ECCN_US/EU: n/a; Manuf_Part_1: BLM18PG121SN1D; Manuf_1: MURATA
LD4 = LED_red: as LD6 on sheet ST_LINK_V2-1; Order: 19-213-R6C-AP1Q2B/3T
LD5 = LED_green: LED, green, 0603; Manuf_1: everlight; Manuf_Part_1: 19-213SYGC/S530-E2/TR8; ECCN_US/EU: EAR99/NEC; Order: 19-213SYGC/S530-E2/TR8
R65 = Res_620_1%_0603: Resistor,620,0603,1%,VISHAY; Manuf_Part_1: CRCW0603620RFKEA; Manuf_1: VISHAY DRALORIC; Value: 620; Order: 2122341; ECCN_US/EU: n/a; Distrib: FARNELL
R66 = Res_330_1%_0402: Resistor,330,0402,1%,YAGEO; Manuf_Part_1: RC0402FR-07330RL; Value: 330; ECCN_US/EU: n/a; Manuf_1: YAGEO; Distrib: DIGIKEY; Order: RC0402FR-07330RL
R123 R125 R126 R137 = Res_0_5%_0402: Resistor,0,0402,5%,YAGEO; Manuf_Part_1: RC0402JR-070RL; Value: 0; Order: 2363467; ECCN_US/EU: n/a; Manuf_1: YAGEO; Distrib: FARNELL
R124 R128 R133 = Res_NA_0402: Resistor,[NA],0402; Fitted: NO; Value: [NA]; ECCN_US/EU: n/a
R129 = Res_0_5%_0402: as R88 on sheet AUDIO; Value: 0; ECCN_US/EU: n/a; Manuf_1: YAGEO; Distrib: FARNELL
R130 = Res_3K3_1%_0402: Resistor,3K3,0402,1%,YAGEO; Manuf_Part_1: RC0402FR-073K3L; Value: 3K3; Manuf_1: YAGEO; Order: *; ECCN_US/EU: n/a; Distrib: FARNELL
R131 = Res_100K_1%_0402: as R118 on sheet ST_LINK_V2-1; Value: 100K; Manuf_1: YAGEO; ECCN_US/EU: n/a; Manuf_2: YAGEO
R132 = Res_47K_1%_0402: Resistor,47K,0402,1%,YAGEO; Manuf_Part_1: RC0402FR-0747KL; Order: 9239430; Value: 47K; Manuf_1: YAGEO; ECCN_US/EU: n/a; Distrib: FARNELL
R134 = Res_10K_1%_0402: as R122 on sheet ST_LINK_V2-1; Value: 10K; Manuf_1: YAGEO; Order: RC0402FR-0710KL; ECCN_US/EU: n/a
R136 = Res_100_1%_0402: Resistor,100,0402,1%,YAGEO; Manuf_Part_1: RC0402FR-07100RL; Value: 100; Order: 9239111; Manuf_1: YAGEO; ECCN_US/EU: n/a; Distrib: FARNELL
R139 = Res_8K06_1%_0402: Resistor,8K06,0402,1%,YAGEO; Manuf_Part_1: RC0402FR-078K06L; Value: 8K06; Manuf_1: YAGEO; Order: RC0402FR-078K06L; ECCN_US/EU: n/a; Distrib: DIGIKEY
R142 = Res_820_1%_0805: Resistor,820,0805,1%,YAGEO; Manuf_Part_1: RC0805FR-07820RL; Value: 820; Manuf_1: YAGEO; Order: RC0805FR-07820RL; ECCN_US/EU: n/a
T5 = 9013-SOT23: as T3 on sheet ST_LINK_V2-1; Revision: July-2002: Re-released for DXP Platform.; Distrib: FARNELL
U20 = USB3320C-EZK: USB3320C,  Hi-Speed USB Host, Device or OTG PHY with ULPI Low Pin Interface; Manuf_1: MICROCHIP; Manuf_Part_1: USB3320C-EZK-TR; ECCN_US/EU: EAR99/NEC; Provided: Sub Co; Distrib: MICROCHIP; Order: USB3320C-EZK-TR
U21 = STMPS2151STR: Enhanced single channel power switches; Manuf_1: STM; Provided: ST; ECCN_US/EU: EAR99/NEC; Ref St: xxxxxx; Order: STMPS2151STR; Manuf_Part_1: STMPS2151STR; Distrib: ST
X4 = OSC_24M_NZ2520SB: Oscillator 24.00Mhz, -+50PPM, 3.3V, Temp -55 to +125°C; Manuf_Part_2: KC2520B24.0000C10E00; Manuf_1: NDK; Manuf_Part_1: NZ2520SB 24MHz END4869A; Manuf_2: AVX Corp/Kyocera Corp; ECCN_US/EU: EAR99/NEC; Ref St: 9157032; Provided: ST; Order: *

## Sheet Ethernet.SchDoc: Ethernet PHY with RJ45 connector
size A4; Date: 29-OCT-2015; Author: A.B; CompanyName: STMicroelectronics; Organization: MCD/TOOLS/GNB; Address1: 12, Rue Jules HOROWITZ; Address2: 38019 Grenoble; Address3: FRANCE; DocumentNumber: MB1225; Revision: B-01; SheetNumber: 10; SheetTotal: 13; Project: STM32F769I-DISCO
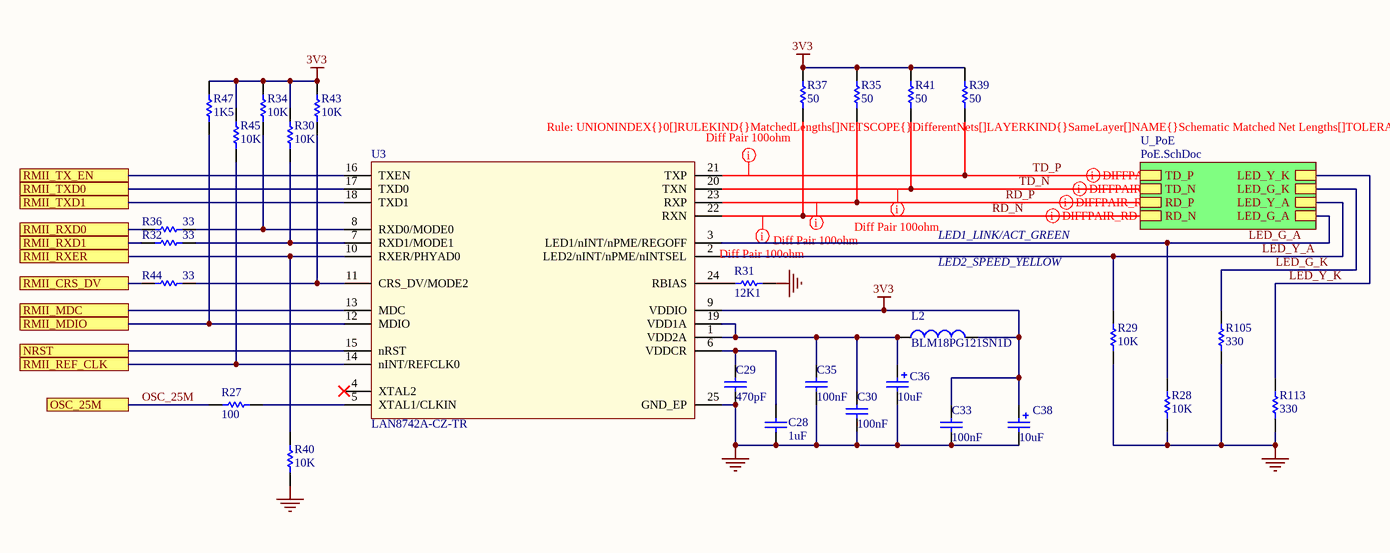
[diagram p5: Ethernet.SchDoc]

### Parts
C28  1uF  [0603C]
C29  470pF  [0402C]
C30  100nF  [0402C]
C33  100nF  [0402C]
C35  100nF  [0402C]
C36  10uF  [TAN-A]
C38  10uF  [TAN-A]
L2  BLM18PG121SN1D  [0603L]
R27  100  [0402R]
R28  10K  [0402R]
R29  10K  [0402R]
R30  10K  [0402R]
R31  12K1  [0603R]
R32  33  [0402R]
R34  10K  [0402R]
R35  50  [0402R]
R36  33  [0402R]
R37  50  [0402R]
R39  50  [0402R]
R40  10K  [0402R]
R41  50  [0402R]
R43  10K  [0402R]
R44  33  [0402R]
R45  10K  [0402R]
R47  1K5  [0402R]
R105  330  [0402R]
R113  330  [0402R]
U3  LAN8742A-CZ-TR  [QFN24_0R5_4X4]

### Sub-sheets
U_PoE = PoE.SchDoc: LED_G_A, LED_G_K, LED_Y_A, LED_Y_K, RD_P, TD_N, TD_P, RD_N

### Ports
NRST, OSC_25M, RMII_CRS_DV, RMII_MDC, RMII_MDIO, RMII_REF_CLK, RMII_RXD0, RMII_RXD1, RMII_RXER, RMII_TX_EN, RMII_TXD0, RMII_TXD1

### Nets
3V3: C33.2 C38.1 L2.2 R30.2 R34.2 R35.1 R37.1 R39.1 R41.1 R43.2 R45.2 R47.2 U3.9(VDDIO)
GND: C28.1 C29.1 C30.1 C33.1 C35.1 C36.2 C38.2 R28.1 R29.1 R31.2 R40.1 R105.1 R113.1 U3.25(GND_EP)  [project net POE7]
LED_G_A: R28.2 U3.3(LED1/nINT/nPME/REGOFF) ; sheet U_PoE/LED_G_A
LED_G_K: R105.2 ; sheet U_PoE/LED_G_K
LED_Y_A: R29.2 U3.2(LED2/nINT/nPME/nINTSEL) ; sheet U_PoE/LED_Y_A
LED_Y_K: R113.2 ; sheet U_PoE/LED_Y_K
NRST: U3.15(nRST) ; port NRST
OSC_25M: R27.1 ; port OSC_25M
RD_N: R37.2 U3.22(RXN) ; sheet U_PoE/RD_N
RD_P: R35.2 U3.23(RXP) ; sheet U_PoE/RD_P
RMII_CRS_DV: R44.2 ; port RMII_CRS_DV
RMII_MDC: U3.13(MDC) ; port RMII_MDC
RMII_MDIO: R47.1 U3.12(MDIO) ; port RMII_MDIO
RMII_REF_CLK: R45.1 U3.14(nINT/REFCLK0) ; port RMII_REF_CLK
RMII_RXD0: R36.2 ; port RMII_RXD0
RMII_RXD1: R32.2 ; port RMII_RXD1
RMII_RXER: R40.2 U3.10(RXER/PHYAD0) ; port RMII_RXER
RMII_TX_EN: U3.16(TXEN) ; port RMII_TX_EN
RMII_TXD0: U3.17(TXD0) ; port RMII_TXD0
RMII_TXD1: U3.18(TXD1) ; port RMII_TXD1
TD_N: R41.2 U3.20(TXN) ; sheet U_PoE/TD_N
TD_P: R39.2 U3.21(TXP) ; sheet U_PoE/TD_P
NetC28_2: C28.2 C29.2 U3.6(VDDCR)
NetC30_2: C30.2 C35.2 C36.1 L2.1 U3.1(VDD2A) U3.19(VDD1A)
NetR27_2: R27.2 U3.5(XTAL1/CLKIN)
NetR30_1: R30.1 R32.1 U3.7(RXD1/MODE1)
NetR31_1: R31.1 U3.24(RBIAS)
NetR34_1: R34.1 R36.1 U3.8(RXD0/MODE0)
NetR43_1: R43.1 R44.1 U3.11(CRS_DV/MODE2)

Not connected (* = marked no-connect by the designer): U3 4(XTAL2)*

### Layout directives
differential pair: RD_N, RD_P, TD_N, TD_P
rule Matched Net Lengths [Tolerance = 100mil]: RD_N, RD_P, TD_N, TD_P

### Notes on the sheet
- LED2_SPEED_YELLOW
- LED1_LINK/ACT_GREEN
- Title:
- Project:
- Size:
- Revision:
- Variant:
- A4
- -
- Date:
- Reference:
- Sheet:
- of

### Library data of the parts
C28 = Cap_1uF_X5R_10%_0603: as C41 on sheet ST_LINK_V2-1; Revision: July-2002: Re-released for DXP Platform.; Value: 1uF; Order: CC0603KRX5R7BB105; Manuf_1: YAGEO; ECCN_US/EU: n/a
C29 = Cap_470pF_X7R_10%_0402: Capacitor,470pF,16V,X7R,10%,0402,YAGEO; Manuf_Part_1: 0402YC471KAT4A; Revision: July-2002: Re-released for DXP Platform.; Value: 470pF; Order: 0402YC471KAT4A; Manuf_1: YAGEO; ECCN_US/EU: n/a
C30 C33 C35 = Cap_100nF_X7R_10%_0402: as C42 on sheet ST_LINK_V2-1; Revision: July-2002: Re-released for DXP Platform.; Value: 100nF; Order: CC0402KRX7R7BB104; Manuf_1: YAGEO
C36 C38 = Cap_10uF_POL_10%_TANA: Polarized Capacitor,10uF,10V,10%,typeA,VISHAY; Manuf_Part_1: 293D106X9010A2TE3; Revision: July-2002: Re-released for DXP Platform.; Value: 10uF; Manuf_1: VISHAY; Order: *; ECCN_US/EU: n/a
L2 = BEAD_120R_2A_0603: as L7 on sheet USB_OTG_HS; Revision: July-2002: Re-released for DXP Platform.; ECCN_US/EU: n/a; Manuf_Part_1: BLM18PG121SN1D; Manuf_1: MURATA
R27 = Res_100_1%_0402: as R143 on sheet ST_LINK_V2-1; Value: 100; Manuf_1: YAGEO; ECCN_US/EU: n/a; Distrib: FARNELL
R28-R30 R34 R40 R43 R45 = Res_10K_1%_0402: as R122 on sheet ST_LINK_V2-1; Value: 10K; Manuf_1: YAGEO; Order: RC0402FR-0710KL; ECCN_US/EU: n/a
R31 = Res_12K1_1%_0603: Resistor,12K1,0603,1%,VISHAY; Manuf_Part_1: MCT 0603-50 1% P5 12K1; Order: 2325243; Value: 12K1; ECCN_US/EU: n/a; Manuf_1: VISHAY; Distrib: FARNELL
R32 R36 R44 = Res_33_1%_0402: Resistor,33,0402,1%,YAGEO; Manuf_Part_1: RC0402FR-0733RL; Value: 33; Manuf_1: YAGEO; Order: *; ECCN_US/EU: n/a; Distrib: FARNELL
R35 R37 R39 R41 = Res_50_1%_0402: Resistor,50,0402,1%,YAGEO; Manuf_Part_1: RC0402FR-0750RL; Value: 50; Manuf_1: YAGEO; Order: *; ECCN_US/EU: n/a; Distrib: FARNELL
R47 = Res_1K5_1%_0402: as R148 on sheet ST_LINK_V2-1; Value: 1K5; Manuf_1: YAGEO; Order: RC0402FR-071K5L; ECCN_US/EU: n/a; Distrib: FARNELL
R105 R113 = Res_330_1%_0402: as R60 on sheet ST_LINK_V2-1; Value: 330; ECCN_US/EU: n/a; Manuf_1: YAGEO; Distrib: DIGIKEY; Order: RC0402FR-07330RL
U3 = LAN8742A-CZ-TR: LAN8742A-CZ-TR - Small Footprint RMII 10/100 Ethernet, Transceiver with HP Auto-MDIX and flexPWR Technology SQFN-24; Manuf_1: MICROCHIP; ECCN_US/EU: EAR99/NEC; Provided: Sub Co; Order: LAN8742A-CZ-TR; Manuf_Part_1: LAN8742A-CZ-TR; Distrib: MICROCHIP